# EasyEDA schematic SCH_Slime_Wemos.json
TITLE: SP_Slime; REV: 1.0; Date: 2024-09-12; Sheet: 1/1; Drawn By: Spring_esc; Company: spring_esc
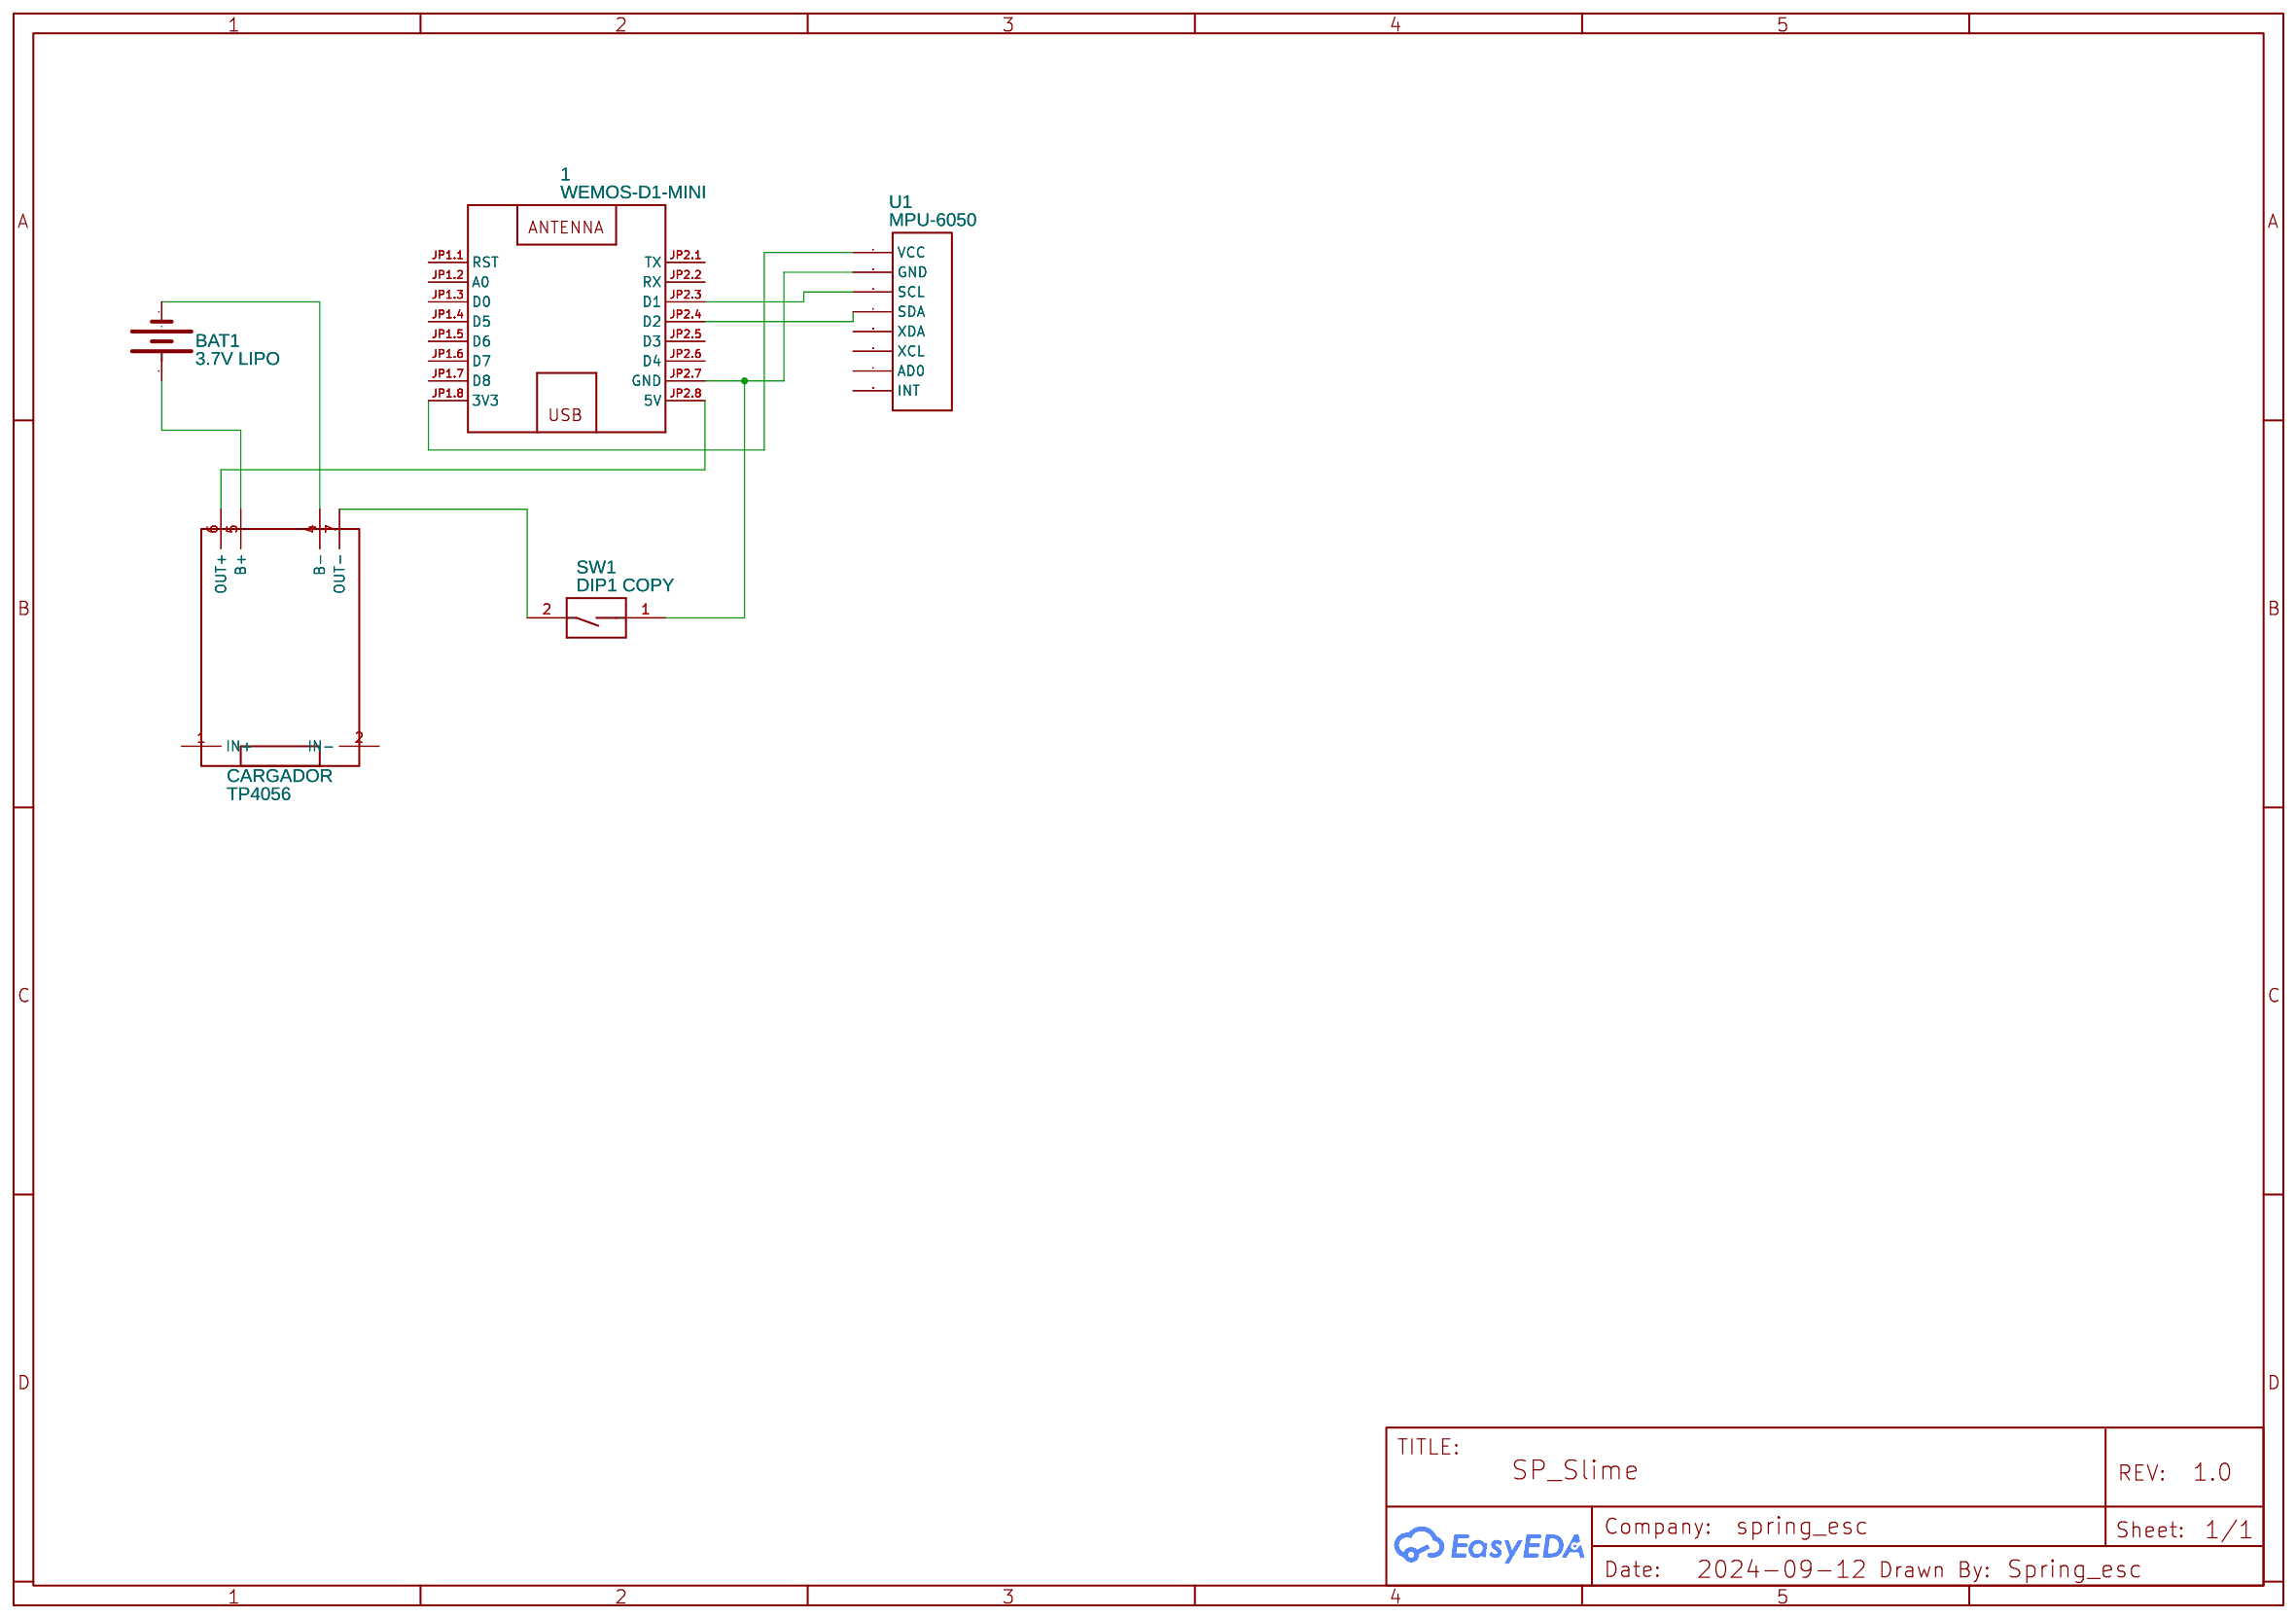
[diagram p0: schematic sheet]

## Parts
1  WEMOS-D1-MINI  [WEMOS-D1-MINI]
BAT1  3.7V LIPO  [LIPO-110-TABS]
CARGADOR  TP4056  [TP4056-PROTECT]
SW1  DIP1 COPY  [DIP SWITCH DIP1]
U1  MPU-6050  [MPU-6050]

## Library data of the parts
1 = WEMOS-D1-MINI: Contributor: Baylin Bridges
BAT1 = 3.7V LIPO: Lipo Battery Pack; Contributor: MoVitro
CARGADOR = TP4056: Manufacturer Part: TP4056-protect; link: https://dlnmh9ip6v2uc.cloudfront.net/datasheets/Prototyping/TP4056.pdf; Contributor: Elite Flower
SW1 = DIP1 COPY: Supplier: Digi-Key; Manufacturer: Omron Electronics Inc-EMC Div; Manufacturer Part: A6TN-1101; Supplier Part: Z12167-ND
U1 = MPU-6050: Supplier Part: undefined; Contributor: Tiago Ferreira

## Nets
Net-(1-JP1.8): 1.JP1.8(3V3) U1.1(VCC)
Net-(1-JP2.3): 1.JP2.3(D1) U1.3(SCL)
Net-(1-JP2.4): 1.JP2.4(D2) U1.4(SDA)
Net-(1-JP2.7): 1.JP2.7(GND) SW1.1 U1.2(GND)
Net-(1-JP2.8): 1.JP2.8(5V) CARGADOR.6(OUT+)
Net-(BAT1-+): BAT1.+ CARGADOR.5(B+)
Net-(BAT1--): BAT1.- CARGADOR.4(B-)
Net-(CARGADOR-7): CARGADOR.7(OUT-) SW1.2

Not connected (* = marked no-connect by the designer): 1 JP1.1(RST) JP1.2(A0) JP1.3(D0) JP1.4(D5) JP1.5(D6) JP1.6(D7) JP1.7(D8) JP2.1(TX) JP2.2(RX) JP2.5(D3) JP2.6(D4); CARGADOR 1(IN+) 2(IN-); U1 5(XDA) 6(XCL) 7(AD0) 8(INT)
